# Altium schematic sheet Power.SchDoc: Power
size A4; Date: 9/24/2014; Author: P.A.; CompanyName: STMicroelectronics; Organization: Microcontrollers Division; Address1: 12, Rue Jules HOROWITZ; Address2: 38019 Grenoble; Address3: FRANCE; DocumentNumber: MB1209; Revision: D-02; SheetNumber: 3; SheetTotal: 11; Project: STM32F412G-DISCO; ModifiedDate: 6/2/2016
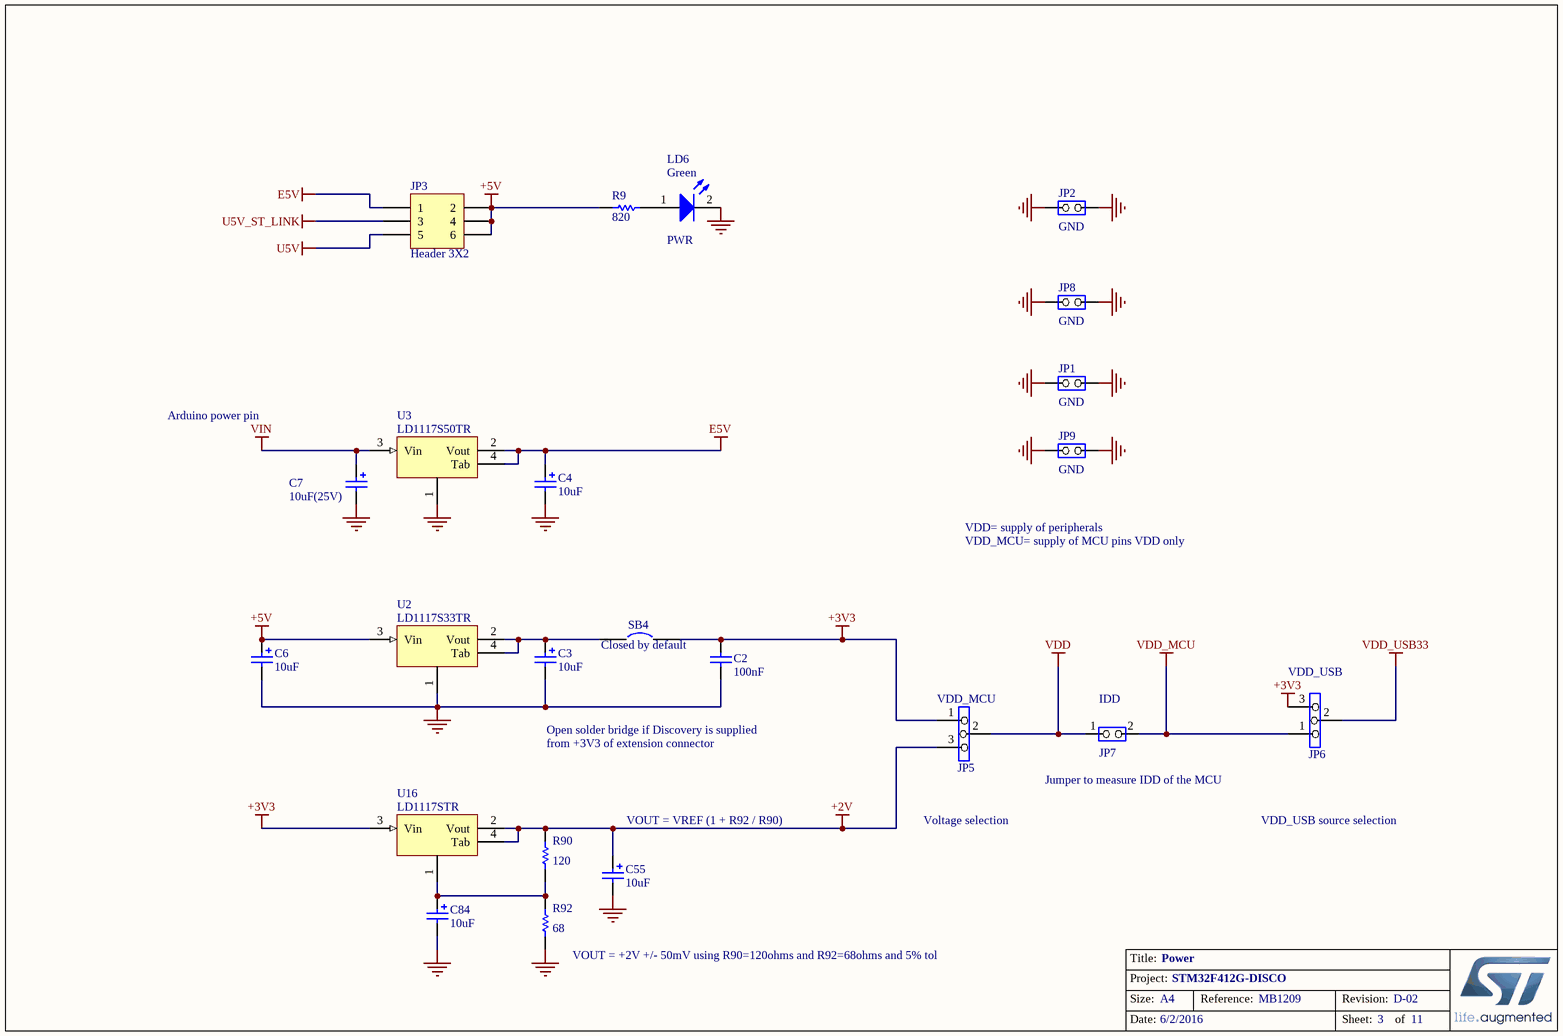
[diagram p0: Power.SchDoc]

## Parts
C2  100nF  [0402C]
C3  10uF  [TAN-A]
C4  10uF  [TAN-A]
C6  10uF  [TAN-A]
C7  10uF(25V)  [TAN-B]
C55  10uF  [TAN-A]
C84  10uF  [TAN-A]
JP1  Silkscreen: GND  [SIP2]  (hidden comment: Jumper2)
JP2  Silkscreen: GND  [SIP2]  (hidden comment: Jumper2)
JP3  Header 3X2  [HDR_2X3_2R54]
JP5  Jumper3  [SIP3]  (value not drawn)
JP6  Jumper3  [SIP3]  (value not drawn)
JP7  Jumper2  [SIP2]  (value not drawn)
JP8  Silkscreen: GND  [SIP2]  (hidden comment: Jumper2)
JP9  Silkscreen: GND  [SIP2]  (hidden comment: Jumper2)
LD6  Green  Silkscreen: PWR  [0603D]
R9  820  [0402R]
R90  120  [0603R]
R92  68  [0603R]
SB4  Closed by default  [SB_0603]
U2  LD1117S33TR  [SOT-223]
U3  LD1117S50TR  [SOT-223]
U16  LD1117STR  [SOT-223]

## Nets
+2V: C55.1 JP5.3 R90.1 U16.2(Vout) U16.4(Tab)
+3V3: C2.1 JP5.1 JP6.3 SB4.2 U16.3(Vin)
+5V: C6.1 JP3.2 JP3.4 JP3.6 R9.2 U2.3(Vin)
E5V: C4.1 JP3.1 U3.2(Vout) U3.4(Tab)
GND: C2.2 C3.2 C4.2 C6.2 C7.2 C55.2 C84.2 JP1.1(COMMON) JP1.2(NO) JP2.1(COMMON) JP2.2(NO) JP8.1(COMMON) JP8.2(NO) JP9.1(COMMON) JP9.2(NO) LD6.2(K) R92.2 U2.1 U3.1
U5V: JP3.5
U5V_ST_LINK: JP3.3
VDD: JP5.2 JP7.1(COMMON)
VDD_MCU: JP6.1 JP7.2(NO)
VDD_USB33: JP6.2
VIN: C7.1 U3.3(Vin)
NetC3_1: C3.1 SB4.1 U2.2(Vout) U2.4(Tab)
NetC84_1: C84.1 R90.2 R92.1 U16.1
NetLD6_1: LD6.1(A) R9.1

## Notes on the sheet
- Arduino power pin
- VDD= supply of peripherals
  VDD_MCU= supply of MCU pins VDD only
- (near JP5) VDD_MCU
- (near JP7) IDD
- (near JP6) VDD_USB
- Open solder bridge if Discovery is supplied
  from +3V3 of extension connector
- (near JP7) Jumper to measure IDD of the MCU
- (near C55) VOUT = VREF (1 + R92 / R90)
- Voltage selection
- VDD_USB source selection
- (near R92) VOUT = +2V +/- 50mV using R90=120ohms and R92=68ohms and 5% tol
- Title:
- Project:
- Size:
- Date:
- A4
- Reference:
- Sheet:
- Revision:
- of

## Library data of the parts
C2 = Cap: Capacitor; Value: 10nF; Ordered by: Subcon; ECCN_US/EU: NA; Published: 8-Jun-2000; Revision: July-2002: Re-released for DXP Platform.; Publisher: Altium Limited
C3 C4 C6 C7 C55 C84 = Cap Pol1: Polarized Capacitor (Radial); Ordered by: Subcon; ECCN_US/EU: NA; Published: 8-Jun-2000; Revision: July-2002: Re-released for DXP Platform.; Publisher: Altium Limited; Value: 10uF
JP1 JP2 JP8 JP9 = JP2: Ordered by: Subcon; Assembly: with jumper; ECCN_US/EU: NA
JP3 = Header 3X2: Header, 3-Pin, Dual row; Ordered by: Subcon; Silkscreen: E5V:pins1,2 STLK: pins3,4 USB: pins 5,6; Assembly: 3,4 closed by jumper; ECCN_US/EU: NA; LatestRevisionDate: 17-Jul-2002; LatestRevisionNote: Re-released for DXP Platform.; Publisher: Altium Limited
JP5 = Jumper3: Ordered by: Subcon; Silkscreen: +3V3: pins 1&2 +1V8: pins 2&3; ECCN_US/EU: NA
JP6 = Jumper3: Ordered by: Subcon; Silkscreen: VDD: pins 1&2 +3V3 pins 2&3; ECCN_US/EU: NA
JP7 = JP2: Ordered by: Subcon; Assembly: with jumper; Silkscreen: IDD; ECCN_US/EU: NA
LD6 = LED2: Typical RED, GREEN, YELLOW, AMBER GaAs LED; Ordered by: Subcon; ECCN_US/EU: EAR99/NEC; Published: 8-Jun-2000; Revision: July-2002: Re-released for DXP Platform.; Publisher: Altium Limited
R9 R90 R92 = res1: Resistor; Value: 1K; Ordered by: Subcon; ECCN_US/EU: NA; Published: 8-Jun-2000; Revision: July-2002: Re-released for DXP Platform.; Publisher: Altium Limited
SB4 = Circuit Breaker: Ordered by: Subcon; Comments: Solder bridge; ECCN_US/EU: NA; Published: 24-Mar-1999; Revision: July-2002: Re-released for DXP Platform.; Publisher: Altium Limited
U2 = LD1117: Ordered by: ST; ECCN_US/EU: EAR99/NEC; Ref St: 9176186; Manuf_1: ST; Manuf_Part_1: LD1117S33TR
U3 = LD1117: Ordered by: ST; ECCN_US/EU: EAR99/NEC; Ref St: 9176133; Manuf_1: ST; Manuf_Part_1: LD1117S50TR
U16 = LD1117: Ordered by: ST; ECCN_US/EU: EAR99/NEC; Ref St: 9176138; Manuf_1: ST; Manuf_Part_1: LD1117STR